# EAGLE schematic MSSRP-Power (EAGLE 6.6.0)
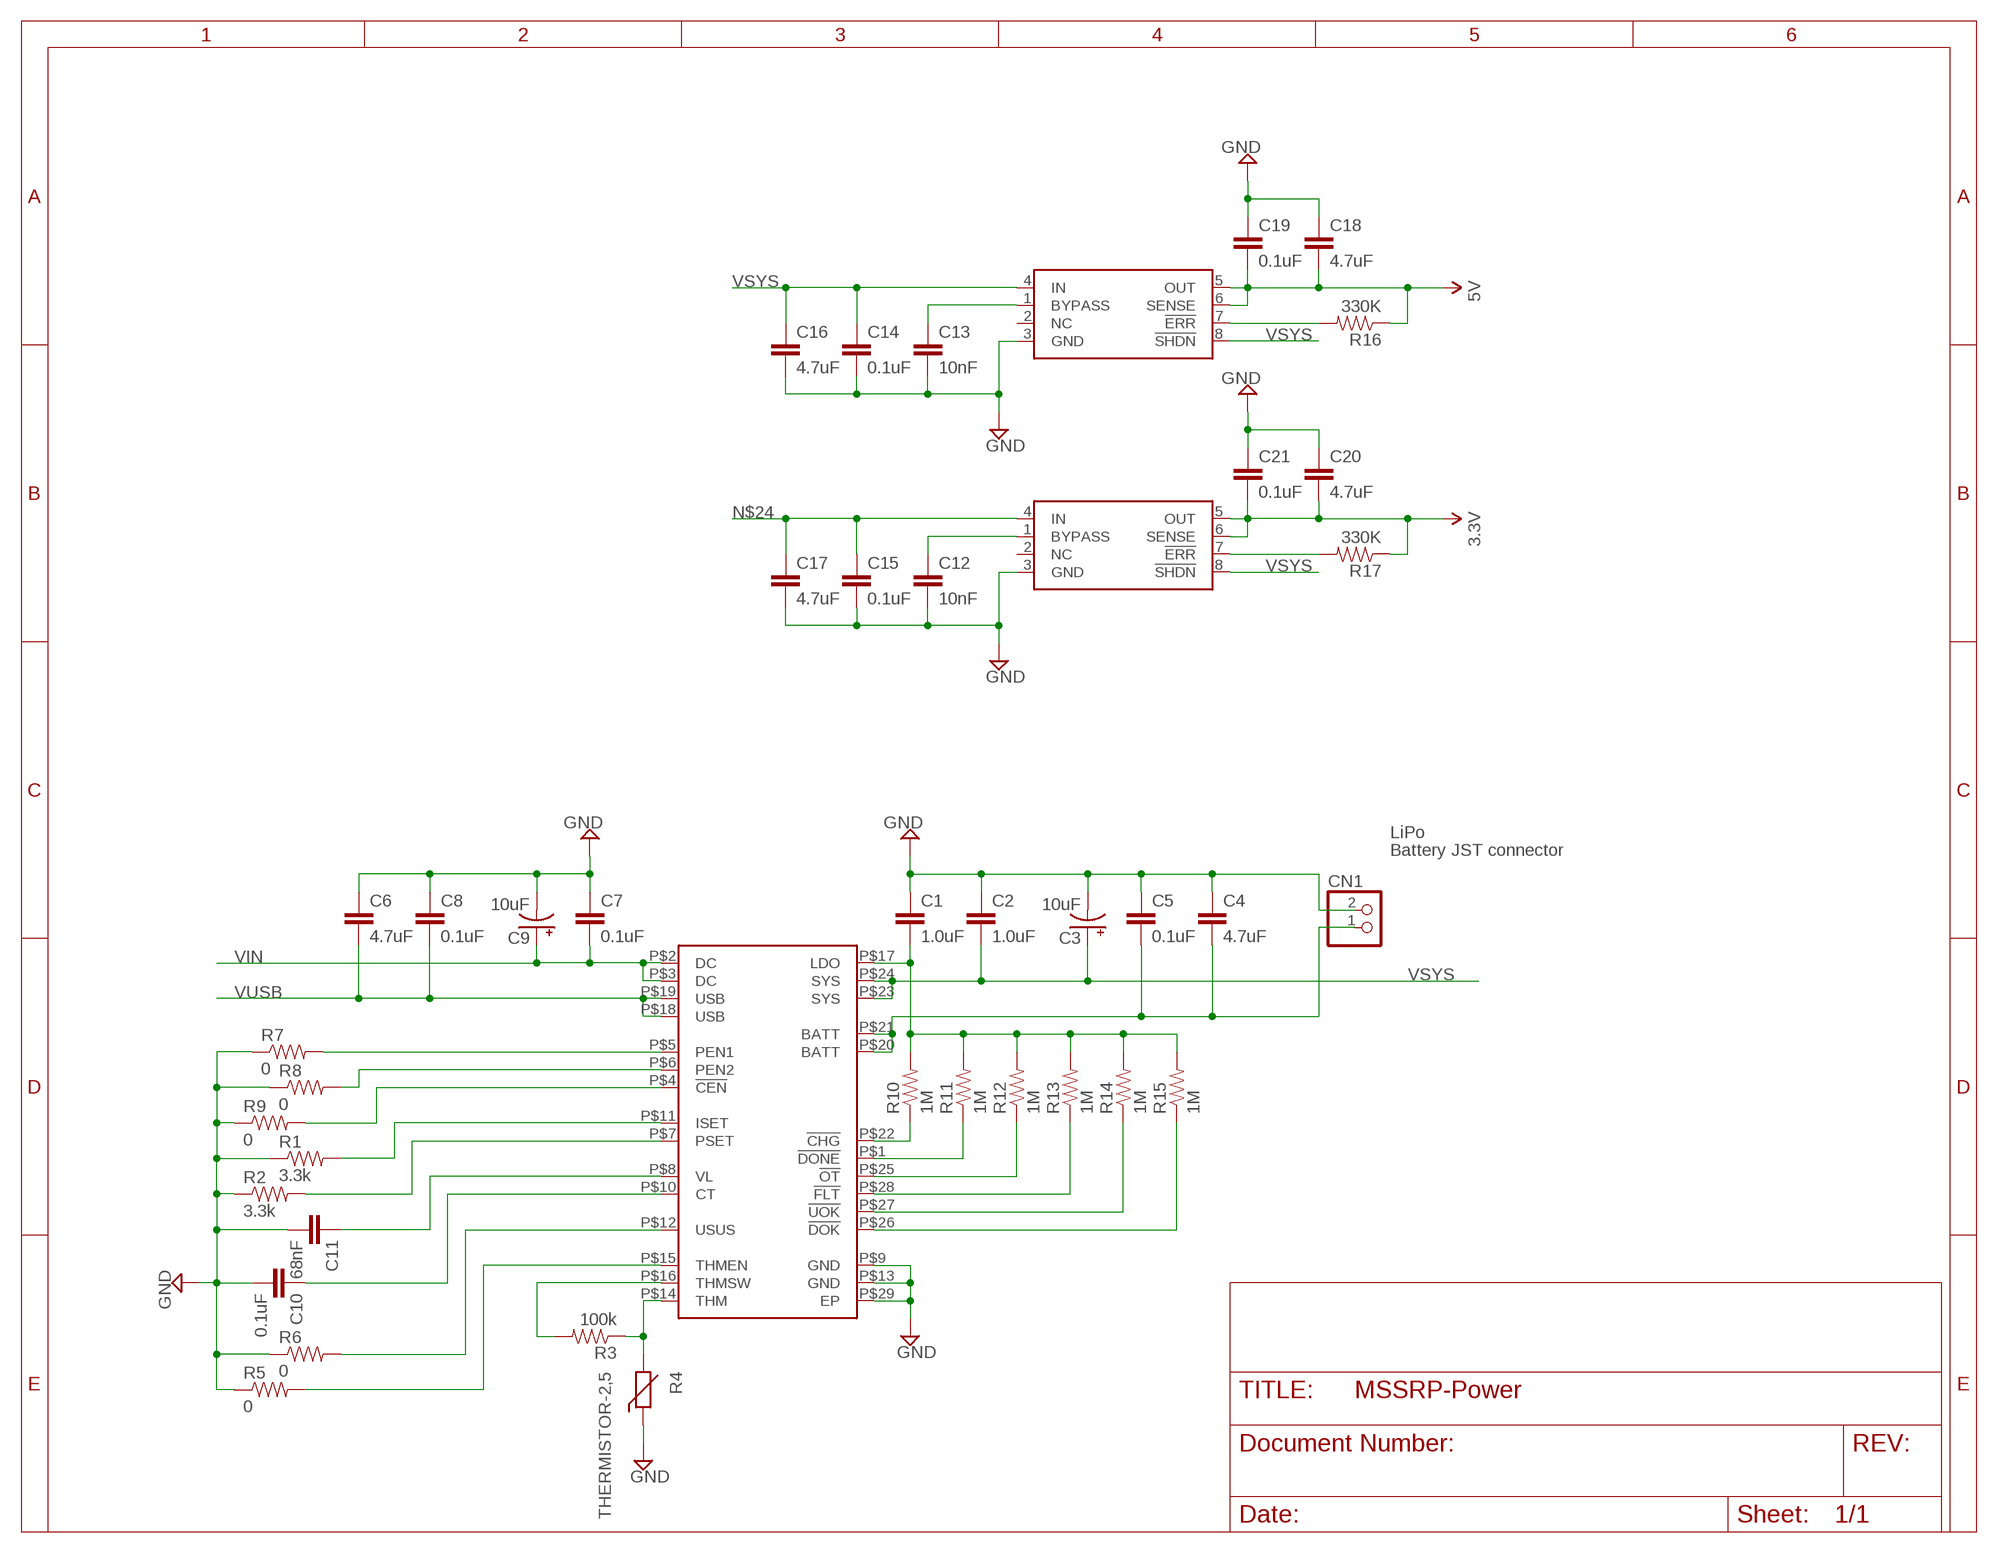
[diagram p0: schematic, sheet 1]

## Parts
C1  1.0uF  1.0UF-16V-10%(0603)  [0603-CAP]
C2  1.0uF  1.0UF-16V-10%(0603)  [0603-CAP]
C3  10uF  10UF-16V-10%(TANT)  [EIA3216]
C4  4.7uF  4.7UF-6.3V-10%(0603)0603  [0603-CAP]
C5  0.1uF  0.1UF-25V-5%(0603)  [0603-CAP]
C6  4.7uF  4.7UF-6.3V-10%(0603)0603  [0603-CAP]
C7  0.1uF  0.1UF-25V-5%(0603)  [0603-CAP]
C8  0.1uF  0.1UF-25V-5%(0603)  [0603-CAP]
C9  10uF  10UF-16V-10%(TANT)  [EIA3216]
C10  0.1uF  0.1UF-25V-5%(0603)  [0603-CAP]
C11  68nF  0.1UF-25V-5%(0603)  [0603-CAP]
C12  10nF  10NF/10000PF-50V-10%(0603)  [0603-CAP]
C13  10nF  10NF/10000PF-50V-10%(0603)  [0603-CAP]
C14  0.1uF  0.1UF-25V-5%(0603)  [0603-CAP]
C15  0.1uF  0.1UF-25V-5%(0603)  [0603-CAP]
C16  4.7uF  4.7UF-6.3V-10%(0603)0603  [0603-CAP]
C17  4.7uF  4.7UF-6.3V-10%(0603)0603  [0603-CAP]
C18  4.7uF  4.7UF-6.3V-10%(0603)0603  [0603-CAP]
C19  0.1uF  0.1UF-25V-5%(0603)  [0603-CAP]
C20  4.7uF  4.7UF-6.3V-10%(0603)0603  [0603-CAP]
C21  0.1uF  0.1UF-25V-5%(0603)  [0603-CAP]
CN1  JST_2PIN-THM-RA  [JST-PH-2-THM-RA]
R1  3.3k  3.3MOHM-1/10W-1%(0603)  [0603-RES]
R2  3.3k  3.3MOHM-1/10W-1%(0603)  [0603-RES]
R3  100k  100OHM1/10W1%(0603)  [0603-RES]
R4  THERMISTOR-2,5  [RS-2,5]
R5  0  0OHM1/10W5%(0603)  [0603]
R6  0  0OHM1/10W5%(0603)  [0603]
R7  0  0OHM1/10W5%(0603)  [0603]
R8  0  0OHM1/10W5%(0603)  [0603]
R9  0  0OHM1/10W5%(0603)  [0603]
R10  1M  330KOHM1/10W1%(0603)0603  [0603-RES]
R11  1M  330KOHM1/10W1%(0603)0603  [0603-RES]
R12  1M  330KOHM1/10W1%(0603)0603  [0603-RES]
R13  1M  330KOHM1/10W1%(0603)0603  [0603-RES]
R14  1M  330KOHM1/10W1%(0603)0603  [0603-RES]
R15  1M  330KOHM1/10W1%(0603)0603  [0603-RES]
R16  330K  330KOHM1/10W1%(0603)0603  [0603-RES]
R17  330K  330KOHM1/10W1%(0603)0603  [0603-RES]
U$1  MAX8934A  [QFN28]
U$2  LP2989AIM  [SOIC8]
U$3  LP2989AIM  [SOIC8]

## Nets
3.3V: C20.2 C21.2 R17.1 U$3.5(OUT) U$3.6(SENSE)
5V: C18.2 C19.2 R16.1 U$2.5(OUT) U$2.6(SENSE)
GND: C1.1 C2.1 C3.C(-) C4.1 C5.1 C6.1 C7.1 C8.1 C9.C(-) C10.2 C11.2 C12.2 C13.2 C14.2 C15.2 C18.1 C19.1 C20.1 C21.1 CN1.2 R1.1 R2.1 R4.1 R5.1 R6.1 R7.1 R8.1 R9.1 U$1.P$9(GND) U$1.P$13(GND) U$1.P$29(EP) U$2.3(GND) U$3.3(GND)
N$1: C1.2 R10.2 R11.2 R12.2 R13.2 R14.2 R15.2 U$1.P$17(LDO)
N$2: R10.1 U$1.P$22(!CHG)
N$3: R7.2 U$1.P$5(PEN1)
N$4: R8.2 U$1.P$6(PEN2)
N$5: R9.2 U$1.P$4(!CEN)
N$6: R1.2 U$1.P$11(ISET)
N$7: R3.1 R4.2 U$1.P$14(THM)
N$8: R3.2 U$1.P$16(THMSW)
N$9: R5.2 U$1.P$15(THMEN)
N$10: R2.2 U$1.P$7(PSET)
N$11: R6.2 U$1.P$12(USUS)
N$12: C11.1 U$1.P$8(VL)
N$13: C10.1 U$1.P$10(CT)
N$14: C4.2 C5.2 CN1.1 U$1.P$20(BATT) U$1.P$21(BATT)
N$15: R11.1 U$1.P$1(!DONE)
N$16: R12.1 U$1.P$25(!OT)
N$17: R13.1 U$1.P$28(!FLT)
N$18: R14.1 U$1.P$27(!UOK)
N$19: R15.1 U$1.P$26(!DOK)
N$20: C13.1 U$2.1(BYPASS)
N$23: C12.1 U$3.1(BYPASS)
N$24: C15.1 U$3.4(IN)
N$25: R16.2 U$2.7(!ERR)
N$26: R17.2 U$3.7(!ERR)
VIN: C7.2 C9.A(+) U$1.P$2(DC) U$1.P$3(DC)
VSYS: C2.2 C3.A(+) C14.1 U$1.P$23(SYS) U$1.P$24(SYS) U$2.4(IN) U$2.8(!SHDN) U$3.8(!SHDN)
VUSB: C6.2 C8.2 U$1.P$18(USB) U$1.P$19(USB)
Unconnected: C16.1 C16.2 C17.1 C17.2 U$2.2(NC) U$3.2(NC)

## Notes on the sheet
- LiPo
- Battery JST connector

## Library data of the parts
C1 C2 = SparkFun-Capacitors:1.0UF-16V-10%(0603): CAP-00868; PROD_ID: CAP-00868
C3 C9 = SparkFun-Capacitors:10UF-16V-10%(TANT): CAP-00811 1206/EIA-3216 Tantalum capacitor; PROD_ID: CAP-00811
C4 C6 C16-C18 C20 = SparkFun-Capacitors:4.7UF-6.3V-10%(0603): CAP-08280; PROD_ID: CAP-08280
C5 C7 C8 C10 C14 C15 C19 C21 = SparkFun-Capacitors:0.1UF-25V-5%(0603): CAP-08604; PROD_ID: CAP-08604
C11 = SparkFun-Capacitors:0.1UF-25V-5%(0603): CAP-08604; PROD_ID: CAP-08604; VALUE: 0.1uF
C12 C13 = SparkFun-Capacitors:10NF/10000PF-50V-10%(0603): CAP-00867; PROD_ID: CAP-00867
CN1 = adafruit:JST_2PIN: JST 2-Pin Connectors of various flavors SMT-RA (S2B-PH-SM4) 4UConnector #17311 SMT (B2B-PH-SM4) THM-RA (S2B-PH) THM (B2B-PH)
R1 R2 = SparkFun-Resistors:3.3MOHM-1/10W-1%(0603): RES-11057; PROD_ID: RES-11057
R3 = SparkFun-Resistors:100OHM1/10W1%(0603): RES-07863; PROD_ID: RES-07863; VALUE: 100
R4 = varistor:THERMISTOR: THERMISTOR
R5-R9 = SparkFun-Resistors:0OHM1/10W5%(0603): RES-08609; PROD_ID: RES-08609
R10-R15 = SparkFun-Resistors:330KOHM1/10W1%(0603): RES-08968; PROD_ID: RES-08968; VALUE: 330K
R16 R17 = SparkFun-Resistors:330KOHM1/10W1%(0603): RES-08968; PROD_ID: RES-08968
U$1 = MSSRP-Lib:MAX8934
U$2 U$3 = MSSRP-Lib:LP2989